# Altium schematic sheet Sheet5_MCU_PowerDecoupling.SchDoc
size A; SheetNumber: 5; SheetTotal: 6
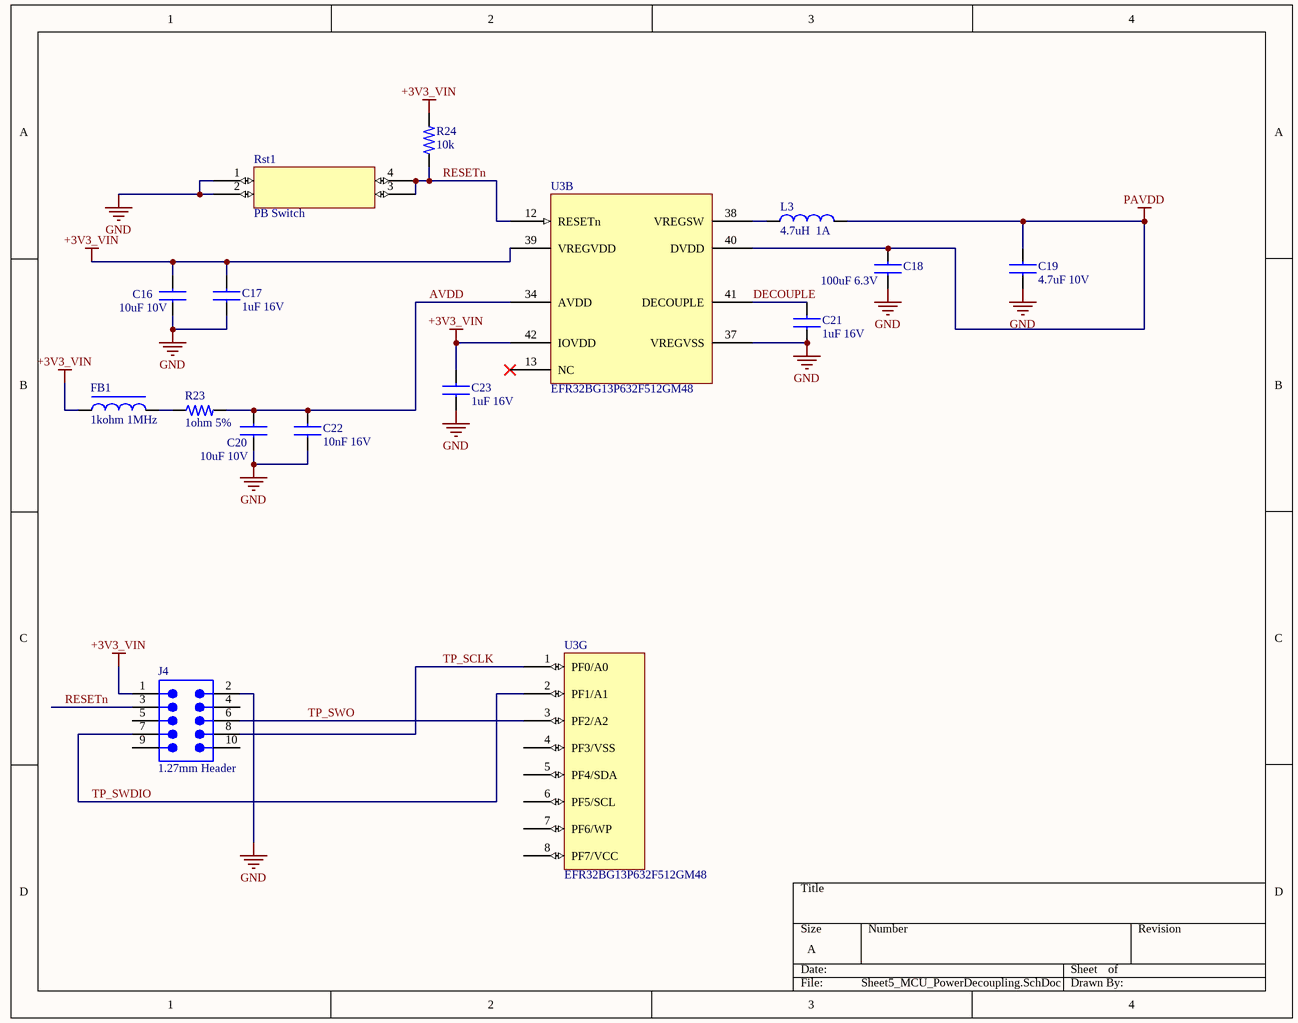
[diagram p0: Sheet5_MCU_PowerDecoupling.SchDoc]

## Parts
C16  10uF 10V  [CAP_0805_1_4MM]
C17  1uF 16V  [CAP_0603_1MM]
C18  100uF 6.3V  [RES_1206_310X16]
C19  4.7uF 10V  [CAP_0603_1MM]
C20  10uF 10V  [CAP_0805_1_4MM]
C21  1uF 16V  [CAP_0603_1MM]
C22  10nF 16V  [CAP_0805_1_4MM]
C23  1uF 16V  [CAP_0603_1MM]
FB1  1kohm 1MHz  [CAP_0603_1MM]
J4  1.27mm Header  [SAMTEC_FTSH-105-XX-X-DV]
L3  4.7uH  1A  [IND_2828x30]
R23  1ohm 5%  [RES_0603_1608X06]
R24  10k  [RES_0805_2X1_25MM]
Rst1  PB Switch  [DFN300P450X290-4N]
U3  EFR32BG13P632F512GM48  [QFN50P700X700X90_HS-49N]  (parts B,G of 7)

## Nets
+3V3_VIN: C16.1 C17.1 C23.1 FB1.1 J4.1 R24.2 U3.39(VREGVDD) U3.42(IOVDD)
GND: C16.2 C17.2 C18.2 C19.2 C20.2 C21.2 C22.2 C23.2 J4.2 Rst1.1(HI_A) Rst1.2(HI_B) U3.37(VREGVSS)
PAVDD: C18.1 C19.1 L3.2 U3.40(DVDD)
AVDD: C20.1 C22.1 R23.2 U3.34(AVDD)
DECOUPLE: C21.1 U3.41(DECOUPLE)
RESETn: J4.3 R24.1 Rst1.3(LO_A) Rst1.4(LO_B) U3.12(RESETn)
TP_SCLK: J4.8 U3.1(PF0/A0)
TP_SWDIO: J4.7 U3.2(PF1/A1)
TP_SWO: J4.6 U3.3(PF2/A2)
NetFB1_2: FB1.2 R23.1
NetL3_1: L3.1 U3.38(VREGSW)

Not connected (* = marked no-connect by the designer): J4 4 5 9 10; U3 4(PF3/VSS) 5(PF4/SDA) 6(PF5/SCL) 7(PF6/WP) 8(PF7/VCC) 13(NC)*

## Library data of the parts
C16 C20 = C0805C106K8PACTU: CAP CER 10UF 10V X5R 0805; Manufacturer: KEMET; Dielectric Material: Ceramic; Tolerance: 10%; Supplier 1: Digi-Key; Manufacturer Part Number: C0805C106K8PACTU; RoHS: Yes; Category: Ceramic Capacitors; Stock 1: 936862; Pricing 1: 1=0.14000, 10=0.10200, 50=0.05780, 100=0.04780, 500=0.03356, 1000=0.02778 (USD); Mount: Surface Mount; Case/Package: 0805; Number of Pins: 2; Contact Plating: Tin,Matte; Case Code (Imperial): 0805; Case Code (Metric): 2012; Min Operating Temperature: -55°C; Max Operating Temperature: 85°C; Capacitance: 10uF; Packaging: Tape and Reel; Dielectric: X5R; Voltage Rating (DC): 10V; Termination: SMD/SMT; Package Quantity: 1; Voltage Rating: 10V; Voltage: 10V; Dissipation Factor: 10%; Series: C; Construction: Flat; Length: 2mm; Width: 1.2mm; Height: 1.25mm; Depth: 1.25mm; Thickness: 0.055inch; Radiation Hardening: No; REACH SVHC: No SVHC; RoHS Compliant: Yes; ComponentLink1URL: https://datasheet.ciiva.com/7842/1732709-7842198.pdf?src-supplier=Element14; ComponentLink1Description: https://datasheet.ciiva.com/7842/1732709-7842198.pdf?src-supplier=Element14; ComponentLink2URL: https://datasheet.ciiva.com/7842/40889-7842552.pdf?src-supplier=Element14; ComponentLink2Description: https://datasheet.ciiva.com/7842/40889-7842552.pdf?src-supplier=Element14; ComponentLink3URL: https://datasheet.ciiva.com/22704/1732709-22704859.pdf?src-supplier=Element14; ComponentLink3Description: https://datasheet.ciiva.com/22704/1732709-22704859.pdf?src-supplier=Element14
C17 C21 C23 = C0603C105K4RAC7411: KEMET - C0603C105K4RAC7411 - Condensatore Ceramico Multistrato SMD, 1 µF, 16 V, 0603 [1608 Metrico], ± 10%, X7R, Serie C KEMET; Supplier 1: Digi-Key; Manufacturer: KEMET; Manufacturer Part Number: C0603C105K4RAC7411; RoHS: Yes; Category: Capacitors; Stock 1: 34224; Pricing 1: 1=0.10000, 10=0.07600, 50=0.04160, 100=0.03400, 500=0.02426, 1000=0.01906, 2500=0.01732, 5000=0.01594 (USD); Case/Package: 0603; Dielectric Material: Ceramic; Min Operating Temperature: -55°C; Max Operating Temperature: 125°C; Capacitance: 1uF; Tolerance: 10%; Packaging: Tape and Reel; Dielectric: X7R; Voltage Rating (DC): 16V; Length: 1.6mm; Depth: 0.8mm; ComponentLink1URL: http://www.farnell.com/datasheets/2747787.pdf?src-supplier=Farnell; ComponentLink1Description: http://www.farnell.com/datasheets/2747787.pdf?src-supplier=Farnell; ComponentLink2URL: http://components.arrow.com/part/dataview/0323_00313824?src-supplier=Arrow+Europe; ComponentLink2Description: http://components.arrow.com/part/dataview/0323_00313824?src-supplier=Arrow+Europe; ComponentLink3URL: http://www.farnell.com/datasheets/2747787.pdf?src-supplier=Newark; ComponentLink3Description: http://www.farnell.com/datasheets/2747787.pdf?src-supplier=Newark; ComponentLink4URL: http://www.farnell.com/datasheets/2747787.pdf?src-supplier=Element14; ComponentLink4Description: http://www.farnell.com/datasheets/2747787.pdf?src-supplier=Element14
C18 = GRM31CR60J107ME39L: 1206 100 uF 6.3 V ±20% Tolerance X5R SMT Multilayer Ceramic Capacitor
C19 = C0603C475K8PAC7411: Cap Ceramic 4.7uF 10V X5R 10% SMD 0603 85°C Paper T/R; Manufacturer: KEMET; Supplier 1: Digi-Key; Manufacturer Part Number: C0603C475K8PAC7411; RoHS: Yes; Category: Capacitors; Stock 1: 15372; Pricing 1: 1=0.31000, 10=0.21400, 50=0.14300, 100=0.12160, 500=0.08580, 1000=0.07508, 2500=0.07150, 5000=0.06614 (USD); Case/Package: 0603; Dielectric Material: Ceramic; Voltage Rating (DC): 10V; Dielectric: X5R; Tolerance: 10%; Capacitance: 4.7uF; Lead Free: Lead Free; RoHS Compliant: Yes
C22 = C0603C103K4REC7867: Cap Cer 0603 10NF 16V X7R 10%; Manufacturer: KEMET; Supplier 1: Digi-Key; Manufacturer Part Number: C0603C103K4REC7867; Stock 1: 7695; Pricing 1: 1=0.12000, 10=0.08800, 50=0.04820, 100=0.03930, 500=0.02810, 1000=0.02208 (USD)
FB1 = 74279266: WURTH ELEKTRONIK - 74279266 - Ferrite Bead, 0603 [1608 Metric], 1 kohm, 200 mA, WE-CBF Series, 0.6 ohm, ± 25%; Manufacturer: Wurth Electronics; Impedance: 1kR; Max DC Current: 200mA; DC Resistance (DCR): 600mR; Test Frequency: 100MHz; Number of Lines: 1; Inductance: 1.8nH; Shielding: Unshielded; Supplier 1: Digi-Key; Manufacturer Part Number: 74279266; RoHS: Yes; Category: Ferrite Beads and Chips; Stock 1: 78275; Pricing 1: 1=0.17000, 50=0.16800, 100=0.15500, 500=0.14800, 1000=0.14100, 2000=0.13400 (USD); Case/Package: SMD/SMT; Case Code (Metric): 1608; Case Code (Imperial): 0603; Core Material: Ferrite; Min Operating Temperature: -55°C; Max Operating Temperature: 125°C; Tolerance: 25%; Packaging: Tape and Reel; Termination: SMD/SMT; Max Current Rating: 200mA; Current Rating: 200mA; Series: WE-CBF; Length: 1.6mm; Width: 0.8mm; Height: 0.8mm; Depth: 0.8mm; Lead Free: Lead Free; REACH SVHC: Unknown; RoHS Compliant: Yes; ComponentLink1URL: https://datasheet.ciiva.com/14634/0900766b801ef1d0-14634816.pdf?src-supplier=Allied+Electronics; ComponentLink1Description: https://datasheet.ciiva.com/14634/0900766b801ef1d0-14634816.pdf?src-supplier=Allied+Electronics; ComponentLink2URL: https://datasheet.ciiva.com/23763/74279266-23763009.pdf?src-supplier=Newark; ComponentLink2Description: https://datasheet.ciiva.com/23763/74279266-23763009.pdf?src-supplier=Newark; ComponentLink3URL: https://datasheet.ciiva.com/11799/0900766b801ef1d0-11799352.pdf?src-supplier=RSComponents; ComponentLink3Description: https://datasheet.ciiva.com/11799/0900766b801ef1d0-11799352.pdf?src-supplier=RSComponents; ComponentLink4URL: https://datasheet.ciiva.com/14971/74279266-14971192.pdf?src-supplier=Digi-Key; ComponentLink4Description: https://datasheet.ciiva.com/14971/74279266-14971192.pdf?src-supplier=Digi-Key; ComponentLink5URL: https://datasheet.ciiva.com/12395/74279266-221135-12395453.pdf?src-supplier=Mouser; ComponentLink5Description: https://datasheet.ciiva.com/12395/74279266-221135-12395453.pdf?src-supplier=Mouser; ComponentLink6URL: https://datasheet.ciiva.com/1466/1705901-1466509.pdf?src-supplier=Element14; ComponentLink6Description: https://datasheet.ciiva.com/1466/1705901-1466509.pdf?src-supplier=Element14; ComponentLink7URL: https://datasheet.ciiva.com/22711/1705901-22711422.pdf?src-supplier=Element14; ComponentLink7Description: https://datasheet.ciiva.com/22711/1705901-22711422.pdf?src-supplier=Element14; ComponentLink8URL: https://datasheet.ciiva.com/48698/001087059-da-01-ml-we-cbf-smd-ferrit-74279266-de-en-48698427.pdf?src-supplier=Conrad; ComponentLink8Description: https://datasheet.ciiva.com/48698/001087059-da-01-ml-we-cbf-smd-ferrit-74279266-de-en-48698427.pdf?src-supplier=Conrad
J4 = FTSH-105-01-L-DV-K-TR: SAMTEC - FTSH-105-01-L-DV-K-TR - Pin Header, Wire-to-Board, 1.27 mm, 2 Rows, 10 Contacts, Surface Mount, FTSH Series; Number of Contacts: 10; Max Current Rating: 1.75A; Gender: Male; Connector Type: Male Pin; Row Spacing: 0.05inch; Supplier 1: Digi-Key; Manufacturer: Samtec; Manufacturer Part Number: FTSH-105-01-L-DV-K-TR; RoHS: Yes; Category: Headers and Wire Housings; Stock 1: 12516; Pricing 1: 1=3.28000, 10=3.14400, 100=2.62000 (USD); Mount: Surface Mount; Contact Plating: Gold; Contact Material: Bronze; Housing Color: Black; Housing Material: Polymer; Color: Black; Min Operating Temperature: -55°C; Max Operating Temperature: 125°C; Number of Rows: 2; Termination: Solder; Packaging: Tape and Reel; Orientation: Straight; Package Quantity: 550; Number of Positions: 10; Current Rating: 1.75A; Series: FTSH; Contact Type: Male Pin; Length: 6.35mm; Pitch: 1.27mm; Depth: 3.43mm; Contact Mating Length: 0.12inch; Radiation Hardening: No; Lead Free: Lead Free; RoHS Compliant: Yes; REACH SVHC: No SVHC; ComponentLink1URL: https://datasheet.ciiva.com/10245/ftsh-mt-10245289.pdf?src-supplier=Avnet; ComponentLink1Description: https://datasheet.ciiva.com/10245/ftsh-mt-10245289.pdf?src-supplier=Avnet; ComponentLink2URL: https://datasheet.ciiva.com/739/ftsh-1xx-xx-xxx-dv-xxx-mkt-739005.pdf?src-supplier=Digi-Key; ComponentLink2Description: https://datasheet.ciiva.com/739/ftsh-1xx-xx-xxx-dv-xxx-mkt-739005.pdf?src-supplier=Digi-Key; ComponentLink3URL: https://datasheet.ciiva.com/23735/81359-23735917.pdf?src-supplier=Newark; ComponentLink3Description: https://datasheet.ciiva.com/23735/81359-23735917.pdf?src-supplier=Newark
L3 = 744029004: Inductor, SMD Temperature range: -40 ... +125 °C Size: 2813: A/B/C/D/E = 2.8/2.8/1.35/0.9/0.9 mm Tolerance: ±30% Type...; Manufacturer: Wurth Electronics; Core Material: Ferrite; Self Resonant Frequency: 65MHz; Shielding: Shielded; Saturation Current: 800mA; DC Resistance (DCR): 200mR; Test Frequency: 100kHz; Max DC Current: 1.2A; Supplier 1: Digi-Key; Manufacturer Part Number: 744029004; RoHS: Yes; Category: Fixed Inductors; Stock 1: 14904; Pricing 1: 1=1.43000, 10=1.38900, 50=1.21500, 100=1.14600, 500=0.98000 (USD); Mount: Surface Mount; Case/Package: Nonstandard; Number of Pins: 2; Min Operating Temperature: -40°C; Max Operating Temperature: 125°C; Inductance: 4.7uH; Tolerance: 30%; Inductance Tolerance: 30%; Packaging: Cut Tape; Current Rating: 1A; Package Quantity: 1200; Resistor Type: Wirewound; Termination: SMD/SMT; RMS Current (Irms): 1A; Series Resistance: 200mR; Series: WE-TPC; Length: 2.8mm; Width: 2.8mm; Height: 1.35mm; Height - Seated (Max): 0.059inch; Depth: 2.8mm; REACH SVHC: Unknown; RoHS Compliant: Yes; ComponentLink1URL: https://datasheet.ciiva.com/11802/0900766b80d7f1cb-11802019.pdf?src-supplier=RSComponents; ComponentLink1Description: https://datasheet.ciiva.com/11802/0900766b80d7f1cb-11802019.pdf?src-supplier=RSComponents; ComponentLink2URL: https://datasheet.ciiva.com/1050/744029004-1050762.pdf?src-supplier=Digi-Key; ComponentLink2Description: https://datasheet.ciiva.com/1050/744029004-1050762.pdf?src-supplier=Digi-Key; ComponentLink3URL: https://datasheet.ciiva.com/4961/744029004-72684-4961071.pdf?src-supplier=Mouser; ComponentLink3Description: https://datasheet.ciiva.com/4961/744029004-72684-4961071.pdf?src-supplier=Mouser; ComponentLink4URL: https://datasheet.ciiva.com/22702/69358-22702629.pdf?src-supplier=Element14; ComponentLink4Description: https://datasheet.ciiva.com/22702/69358-22702629.pdf?src-supplier=Element14; ComponentLink5URL: https://datasheet.ciiva.com/1050/744029004-1050763.pdf?src-supplier=Digi-Key; ComponentLink5Description: https://datasheet.ciiva.com/1050/744029004-1050763.pdf?src-supplier=Digi-Key; ComponentLink6URL: https://datasheet.ciiva.com/1050/744029004-1050764.pdf?src-supplier=Digi-Key; ComponentLink6Description: https://datasheet.ciiva.com/1050/744029004-1050764.pdf?src-supplier=Digi-Key; ComponentLink7URL: https://datasheet.ciiva.com/14123/744029004-ch-ger-eng-ds-14123820.pdf?src-supplier=Distrelec; ComponentLink7Description: https://datasheet.ciiva.com/14123/744029004-ch-ger-eng-ds-14123820.pdf?src-supplier=Distrelec
R23 = RMCF0603JT1R00: Res Thick Film 0603 1 Ohm 5% 0.1W(1/10W) ±200ppm/C Molded SMD Paper T/R; Manufacturer: Stackpole Electronics; Resistance: 1R; Max Power Dissipation: 100mW; Temperature Coefficient: 200ppm/°C; Supplier 1: Digi-Key; Manufacturer Part Number: RMCF0603JT1R00; RoHS: Yes; Category: Chip SMD Resistors; Stock 1: 79282; Pricing 1: 1=0.10000, 10=0.02100, 100=0.00840, 1000=0.00379, 2500=0.00329 (USD); Mount: Surface Mount; Case/Package: 0603; Case Code (Metric): 1608; Case Code (Imperial): 0603; Contact Plating: Tin,Matte; Min Operating Temperature: -55°C; Max Operating Temperature: 155°C; Tolerance: 5%; Packaging: Tape and Reel; Resistor Type: Thick Film; Number of Terminations: 2; Features: Automotive AEC-Q200; Series: RMCF; Construction: Rectangular; Length: 0.061inch; Width: 0.031inch; Height: 0.022inch; Depth: 0.8mm; Radiation Hardening: No; Military Standard: Not; RoHS Compliant: Yes; ComponentLink1URL: http://components.arrow.com/part/dataview/47073886S9848743N1174?src-supplier=Arrow+Electronics; ComponentLink1Description: http://components.arrow.com/part/dataview/47073886S9848743N1174?src-supplier=Arrow+Electronics; ComponentLink2URL: https://www.seielect.com/catalog/SEI-RMCF_RMCP.pdf?src-supplier=Avnet; ComponentLink2Description: https://www.seielect.com/catalog/SEI-RMCF_RMCP.pdf?src-supplier=Avnet; ComponentLink3URL: https://www.seielect.com/Catalog/SEI-RMCF_RMCP.pdf?src-supplier=Digi-Key; ComponentLink3Description: https://www.seielect.com/Catalog/SEI-RMCF_RMCP.pdf?src-supplier=Digi-Key; ComponentLink4URL: https://www.seielect.com/catalog/SEI-Packaging.pdf?src-supplier=Digi-Key; ComponentLink4Description: https://www.seielect.com/catalog/SEI-Packaging.pdf?src-supplier=Digi-Key
R24 = RMCF0805FT10K0: RES 10K OHM 1% 1/8W 0805; Manufacturer: Stackpole Electronics; Resistance: 10kR; Power Rating: 125mW; Temperature Coefficient: 100ppm/°C; Supplier 1: Digi-Key; Manufacturer Part Number: RMCF0805FT10K0; RoHS: Yes; Category: Chip SMD Resistors; Stock 1: 2466676; Pricing 1: 1=0.10000, 10=0.02600, 100=0.01040, 1000=0.00466, 2500=0.00405 (USD); Mount: Surface Mount; Case/Package: 0805; Case Code (Metric): 2012; Case Code (Imperial): 0805; Contact Plating: Tin,Matte; Size Code: 0805; Min Operating Temperature: -55°C; Max Operating Temperature: 155°C; Tolerance: 1%; Packaging: Tape and Reel; Resistor Type: Thick Film; Number of Terminations: 2; Max Power Dissipation: 125mW; Features: Automotive AEC-Q200; Series: RMCF; Construction: Rectangular; Length: 2mm; Width: 0.049inch; Height: 0.026inch; Depth: 1.25mm; Radiation Hardening: No; Lead Free: Lead Free; Military Standard: Not; RoHS Compliant: Yes; ComponentLink1URL: https://datasheet.ciiva.com/15193/getdatasheetpartid-362046-15193525.pdf?src-supplier=Verical; ComponentLink1Description: https://datasheet.ciiva.com/15193/getdatasheetpartid-362046-15193525.pdf?src-supplier=Verical
Rst1 = PTS647SK38SMTR2LFS: Switch Tactile N.O. SPST Round Button Gull Wing 0.05A 12VDC 100000Cycles 2.45N SMD T/R; Manufacturer: ITT C&K; Illumination Type: Non-Illuminated; Switch Function: Off-Mom; Actuator Type: Standard; Operating Force: 250gf; Switch Travel: 0.25mm; Ratings: IP40; Supplier 1: Digi-Key; Manufacturer Part Number: PTS647SK38SMTR2LFS; RoHS: No; Category: Tactile Switches; Stock 1: 62118; Pricing 1: 1=0.13000, 10=0.12700, 25=0.12080, 100=0.10970, 250=0.10308, 500=0.09432, 1000=0.07897 (USD); Mount: Surface Mount; Mechanical Life: 100000Cycles; Min Operating Temperature: -20°C; Max Operating Temperature: 70°C; Throw Configuration: SPST; Packaging: Tape and Reel; Termination: Gull Wing; ComponentLink1URL: https://www.ckswitches.com/media/2567/pts647.pdf?src-supplier=Digi-Key; ComponentLink1Description: https://www.ckswitches.com/media/2567/pts647.pdf?src-supplier=Digi-Key
U3 = EFR32BG13P732F512GM48-B_1: BLUE PREMIUM QFN48 2.4G 19 DBM B; Manufacturer: Silicon Labs; Interface: I2C,UART,USART; Frequency: 2.4GHz; Data Rate: 2Mbps; Sensitivity: -102dBm; Memory Size: 64KB; Number of GPIO: 31; Current - Receiving: 11mA; Current - Transmitting: 8.5mA; Supplier 1: Digi-Key; Manufacturer Part Number: EFR32BG13P732F512GM48-B; RoHS: Yes; Category: RF Receivers, Transceivers; Stock 1: 19; Pricing 1: 1=6.48000, 25=6.24040, 100=6.00030, 1000=5.98905 (USD); Min Operating Temperature: -40°C; Max Operating Temperature: 85°C; Packaging: Tray; RoHS Compliant: Yes; ComponentLink1URL: https://www.silabs.com/documents/login/data-sheets/efr32bg13-datasheet.pdf?src-supplier=Digi-Key; ComponentLink1Description: https://www.silabs.com/documents/login/data-sheets/efr32bg13-datasheet.pdf?src-supplier=Digi-Key